# Altium schematic sheet connectors.SchDoc
size A3; SheetNumber: 10; SheetTotal: 15; SheetDescription: Connectors
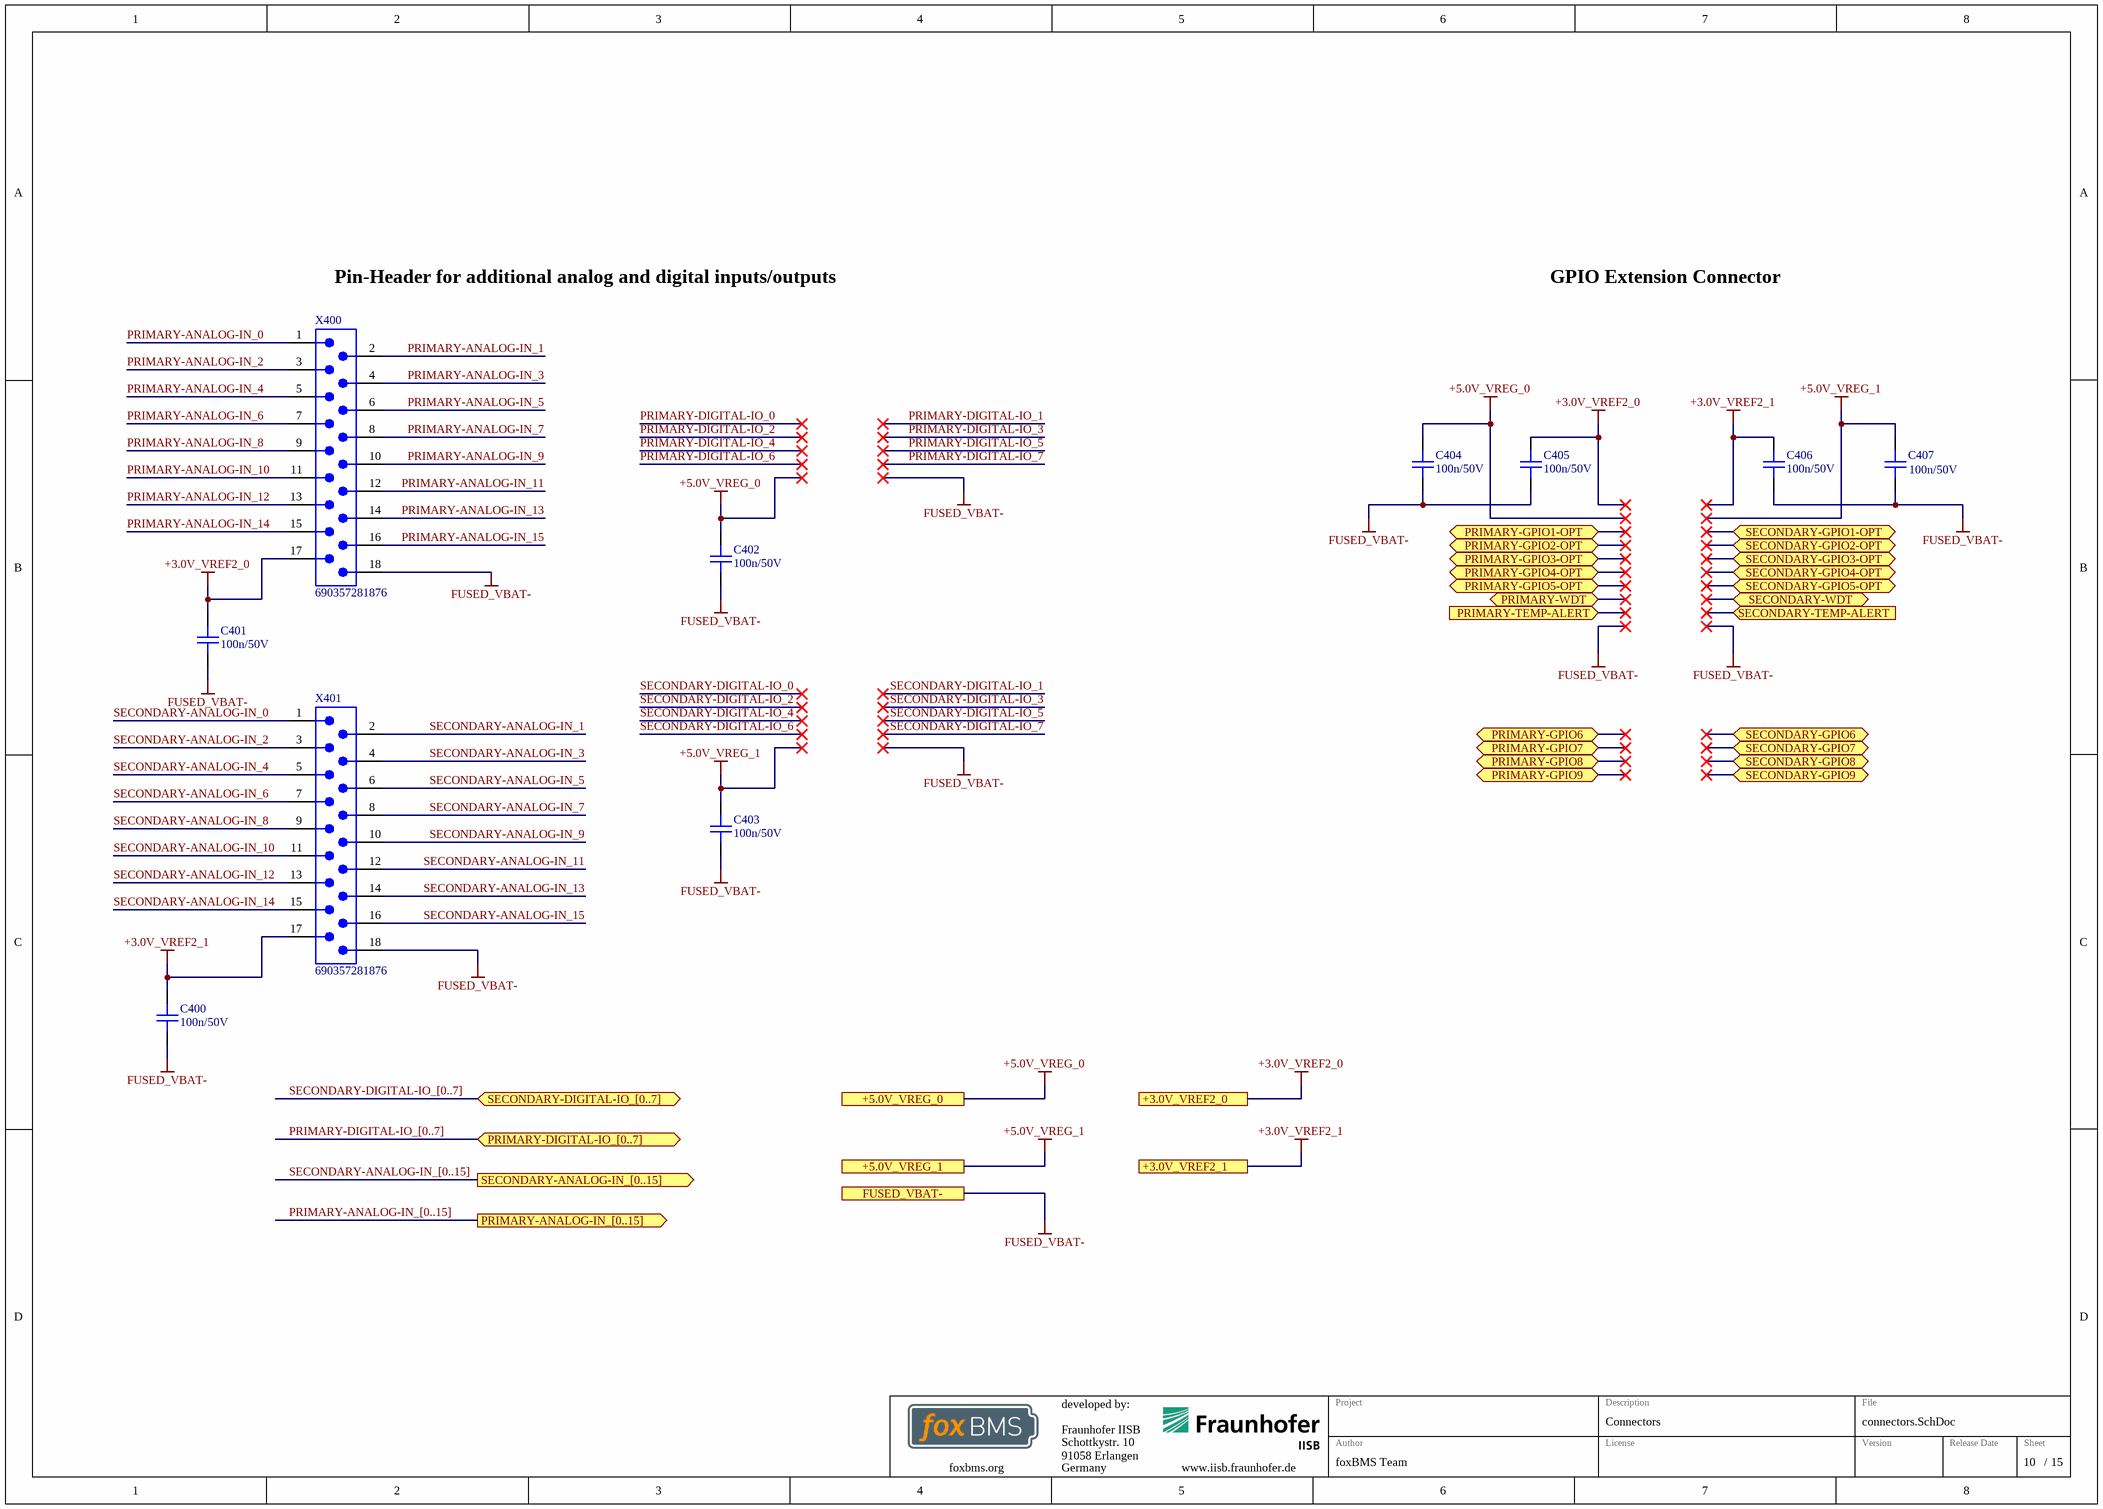
[diagram p0: connectors.SchDoc]

## Parts
C400  100n/50V  [CAPC1608X08N]
C401  100n/50V  [CAPC1608X08N]
C402  100n/50V  [CAPC1608X08N]
C403  100n/50V  [CAPC1608X08N]
C404  100n/50V  [CAPC1608X08N]
C405  100n/50V  [CAPC1608X08N]
C406  100n/50V  [CAPC1608X08N]
C407  100n/50V  [CAPC1608X08N]
X400  690357281876  [690357281876]
X401  690357281876  [690357281876]

## Ports
+3.0V_VREF2_0, +3.0V_VREF2_1, +5.0V_VREG_0, +5.0V_VREG_1, FUSED_VBAT-, PRIMARY-ANALOG-IN_[0..15] (out), PRIMARY-DIGITAL-IO_[0..7] (bidir), PRIMARY-GPIO1-OPT (bidir), PRIMARY-GPIO2-OPT (bidir), PRIMARY-GPIO3-OPT (bidir), PRIMARY-GPIO4-OPT (bidir), PRIMARY-GPIO5-OPT (bidir), PRIMARY-GPIO6 (bidir), PRIMARY-GPIO7 (bidir), PRIMARY-GPIO8 (bidir), PRIMARY-GPIO9 (bidir), PRIMARY-TEMP-ALERT (in), PRIMARY-WDT (bidir), SECONDARY-ANALOG-IN_[0..15] (out), SECONDARY-DIGITAL-IO_[0..7] (bidir), SECONDARY-GPIO1-OPT (bidir), SECONDARY-GPIO2-OPT (bidir), SECONDARY-GPIO3-OPT (bidir), SECONDARY-GPIO4-OPT (bidir), SECONDARY-GPIO5-OPT (bidir), SECONDARY-GPIO6 (bidir), SECONDARY-GPIO7 (bidir), SECONDARY-GPIO8 (bidir), SECONDARY-GPIO9 (bidir), SECONDARY-TEMP-ALERT (in), SECONDARY-WDT (bidir)

## Nets
+3.0V_VREF2_0: C401.2 C405.2 X400.17 ; port +3.0V_VREF2_0
+3.0V_VREF2_1: C400.2 C406.2 X401.17 ; port +3.0V_VREF2_1
+5.0V_VREG_0: C402.2 C404.2 ; port +5.0V_VREG_0
+5.0V_VREG_1: C403.2 C407.2 ; port +5.0V_VREG_1
FUSED_VBAT-: C400.1 C401.1 C402.1 C403.1 C404.1 C405.1 C406.1 C407.1 X400.18 X401.18 ; port FUSED_VBAT-
PRIMARY-ANALOG-IN_0: X400.1
PRIMARY-ANALOG-IN_1: X400.2
PRIMARY-ANALOG-IN_2: X400.3
PRIMARY-ANALOG-IN_3: X400.4
PRIMARY-ANALOG-IN_4: X400.5
PRIMARY-ANALOG-IN_5: X400.6
PRIMARY-ANALOG-IN_6: X400.7
PRIMARY-ANALOG-IN_7: X400.8
PRIMARY-ANALOG-IN_8: X400.9
PRIMARY-ANALOG-IN_9: X400.10
PRIMARY-ANALOG-IN_10: X400.11
PRIMARY-ANALOG-IN_11: X400.12
PRIMARY-ANALOG-IN_12: X400.13
PRIMARY-ANALOG-IN_13: X400.14
PRIMARY-ANALOG-IN_14: X400.15
PRIMARY-ANALOG-IN_15: X400.16
SECONDARY-ANALOG-IN_0: X401.1
SECONDARY-ANALOG-IN_1: X401.2
SECONDARY-ANALOG-IN_2: X401.3
SECONDARY-ANALOG-IN_3: X401.4
SECONDARY-ANALOG-IN_4: X401.5
SECONDARY-ANALOG-IN_5: X401.6
SECONDARY-ANALOG-IN_6: X401.7
SECONDARY-ANALOG-IN_7: X401.8
SECONDARY-ANALOG-IN_8: X401.9
SECONDARY-ANALOG-IN_9: X401.10
SECONDARY-ANALOG-IN_10: X401.11
SECONDARY-ANALOG-IN_11: X401.12
SECONDARY-ANALOG-IN_12: X401.13
SECONDARY-ANALOG-IN_13: X401.14
SECONDARY-ANALOG-IN_14: X401.15
SECONDARY-ANALOG-IN_15: X401.16

## Buses and harness runs
bus PRIMARY-ANALOG-IN_[0..15] = port PRIMARY-ANALOG-IN_[0..15]
bus PRIMARY-DIGITAL-IO_[0..7] = port PRIMARY-DIGITAL-IO_[0..7]
bus SECONDARY-ANALOG-IN_[0..15] = port SECONDARY-ANALOG-IN_[0..15]
bus SECONDARY-DIGITAL-IO_[0..7] = port SECONDARY-DIGITAL-IO_[0..7]

## Notes on the sheet
- Pin-Header for additional analog and digital inputs/outputs
- GPIO Extension Connector
- Fraunhofer IISB
- Schottkystr. 10
- developed by:
- 91058 Erlangen
- Germany
- Author
- Project
- License
- Description
- File
- Version
- Release Date
- Sheet
- foxbms.org <https://foxbms.org>
- www.iisb.fraunhofer.de <https://www.iisb.fraunhofer.de/>
- foxBMS Team
- /

## Library data of the parts
C400-C407 = gen_C_ceramic_100n_50V_X7R_0603: MLCC; Capacitance: 100n; Rated Voltage: 50V; Dielectric: X7R; Case EIA: 0603; Case Metric: 1608; PnP Package: C_0603_10; PnP Value: 100n/50V/X7R; PnP equipped: x; Automotive Qualified: True; Part Number: gen_C_ceramic_100n_50V_X7R_0603; Supplier 1: Farnell; Supplier Part Number 1: 2525267; Supplier 2: Digikey; Supplier Part Number 2: 490-6049-1-ND; Supplier 3: Farnell; Supplier Part Number 3: 2070398
X400 X401 = CMP-1502-00896-2: NexarPartId: 65759599; Pitch: 2.54mm; Current Rating: 1.5A; Gender: Male; Operating Supply Voltage: 100V; Insulation Resistance: 1GΩ; Contact Resistance: 10mΩ; Min Operating Temperature: -40°C; Packaging: Tape and Reel; Lead Pitch: 2.54mm; Length: 23.69mm; RoHS: Compliant; Max Operating Temperature: 105°C; Number of Pins: 18